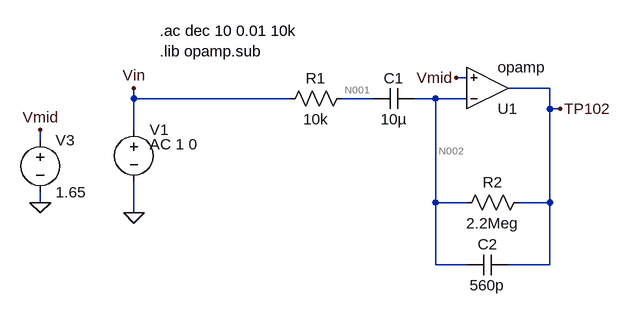
[diagram p0: schematic First_Gain_Stage_Ideal.asc]
First_Gain_Stage_Ideal.asc, the LTspice schematic file:
Version 4
SHEET 1 1220 752
WIRE 320 192 304 192
WIRE 448 208 384 208
WIRE -192 224 -192 208
WIRE 48 224 -192 224
WIRE 176 224 128 224
WIRE 272 224 240 224
WIRE 320 224 272 224
WIRE 448 240 448 208
WIRE 464 240 448 240
WIRE -192 272 -192 224
WIRE -336 288 -336 272
WIRE -336 384 -336 368
WIRE 272 384 272 224
WIRE 320 384 272 384
WIRE 448 384 448 240
WIRE 448 384 400 384
WIRE -192 400 -192 352
WIRE 272 480 272 384
WIRE 320 480 272 480
WIRE 448 480 448 384
WIRE 448 480 384 480
FLAG -192 400 0
FLAG -192 208 Vin
FLAG 304 192 Vmid
FLAG -336 384 0
FLAG -336 272 Vmid
FLAG 464 240 TP102
SYMBOL voltage -192 256 R0
WINDOW 123 24 38 Left 2
SYMATTR Value2 AC 1 0
SYMATTR InstName V1
SYMATTR Value ""
SYMBOL res 144 208 R90
WINDOW 0 0 56 VBottom 2
WINDOW 3 32 56 VTop 2
SYMATTR InstName R1
SYMATTR Value 10k
SYMBOL cap 240 208 R90
WINDOW 0 0 32 VBottom 2
WINDOW 3 32 32 VTop 2
SYMATTR InstName C1
SYMATTR Value 10µ
SYMBOL res 416 368 R90
WINDOW 0 0 56 VBottom 2
WINDOW 3 32 56 VTop 2
SYMATTR InstName R2
SYMATTR Value 2.2Meg
SYMBOL cap 384 464 R90
WINDOW 0 0 32 VBottom 2
WINDOW 3 32 32 VTop 2
SYMATTR InstName C2
SYMATTR Value 560p
SYMBOL voltage -336 272 R0
SYMATTR InstName V3
SYMATTR Value 1.65
SYMBOL Opamps/opamp 352 272 M180
SYMATTR InstName U1
TEXT -152 120 Left 2 !.ac dec 10 0.01 10k\n.lib opamp.sub

The netlist it stands for:
* First_Gain_Stage_Ideal.asc
V1 Vin 0 AC 1 0
R1 N001 Vin 10k
C1 N002 N001 10µ
R2 TP102 N002 2.2Meg
C2 TP102 N002 560p
V3 Vmid 0 1.65
XU1 N002 Vmid TP102 opamp Aol=100K GBW=10Meg  ; pins invin noninvin out
.ac dec 10 0.01 10k
.lib opamp.sub
.backanno
.end

* Results of the author's LTspice run, read from the files saved beside the schematic
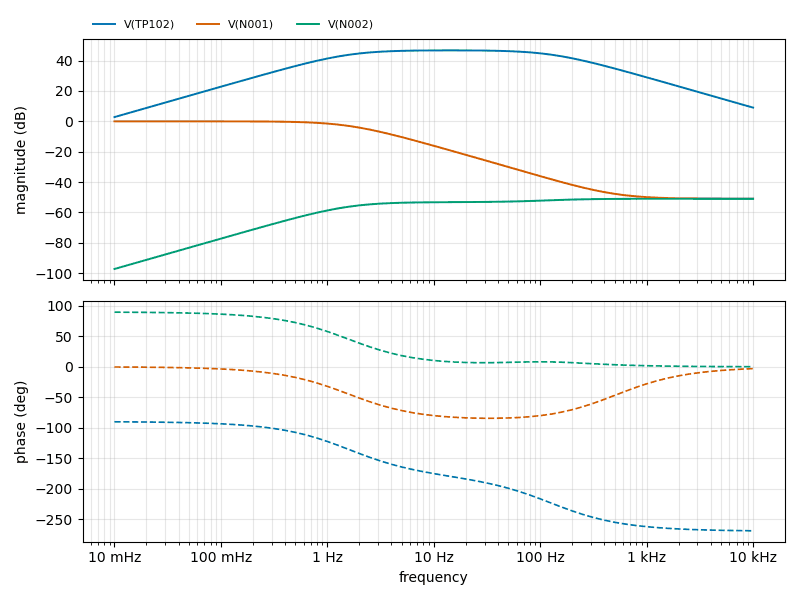
[diagram p1: AC Analysis of First_Gain_Stage_Ideal.asc, plotted from the saved traces]
* AC Analysis, 1 run:
*   V(TP102): 2.81 dB at 10 mHz, 9.05 dB at 10 kHz, peak 46.72 dB at 15.85 Hz, 3 dB below the peak at 1.553 Hz and 131.8 Hz
*   V(N001): -0.00 dB at 10 mHz, -50.94 dB at 10 kHz, peak -0.00 dB at 10 mHz, 3 dB below the peak at 1.588 Hz
*   V(N002): -97.19 dB at 10 mHz, -50.95 dB at 10 kHz, peak -50.95 dB at 10 kHz, 3 dB below the peak at 3.584 Hz